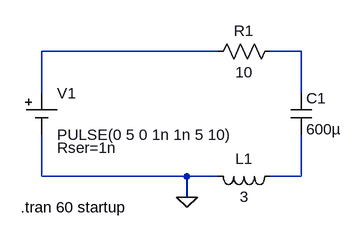
[diagram p0: schematic rlc_fig_ltspice.asc]
rlc_fig_ltspice.asc, the LTspice schematic file:
Version 4
SHEET 1 880 680
WIRE 176 -64 -96 -64
WIRE 304 -64 256 -64
WIRE -96 0 -96 -64
WIRE 304 0 304 -64
WIRE -96 128 -96 64
WIRE 128 128 -96 128
WIRE 176 128 128 128
WIRE 304 128 304 64
WIRE 304 128 256 128
WIRE 128 160 128 128
FLAG 128 160 0
SYMBOL cap 288 0 R0
SYMATTR InstName C1
SYMATTR Value 600µ
SYMBOL ind 272 112 R90
WINDOW 0 5 56 VBottom 2
WINDOW 3 32 56 VTop 2
SYMATTR InstName L1
SYMATTR Value 3
SYMBOL res 272 -80 R90
WINDOW 0 0 56 VBottom 2
WINDOW 3 32 56 VTop 2
SYMATTR InstName R1
SYMATTR Value 10
SYMATTR SpiceLine tol=5% pwr=100W
SYMBOL Misc\\cell -96 0 R0
WINDOW 123 0 0 Left 0
WINDOW 39 24 84 Left 2
SYMATTR SpiceLine Rser=1n
SYMATTR InstName V1
SYMATTR Value PULSE(0 5 0 1n 1n 5 10)
TEXT -128 176 Left 2 !.tran 60 startup

The netlist it stands for:
* rlc_fig_ltspice.asc
C1 N002 N003 600µ
L1 N003 0 3
R1 N002 N001 10 tol=5% pwr=100W
V1 N001 0 PULSE(0 5 0 1n 1n 5 10) Rser=1n
.tran 60 startup
.backanno
.end